# EAGLE design data_proV1.3 (EAGLE 7.6.0)
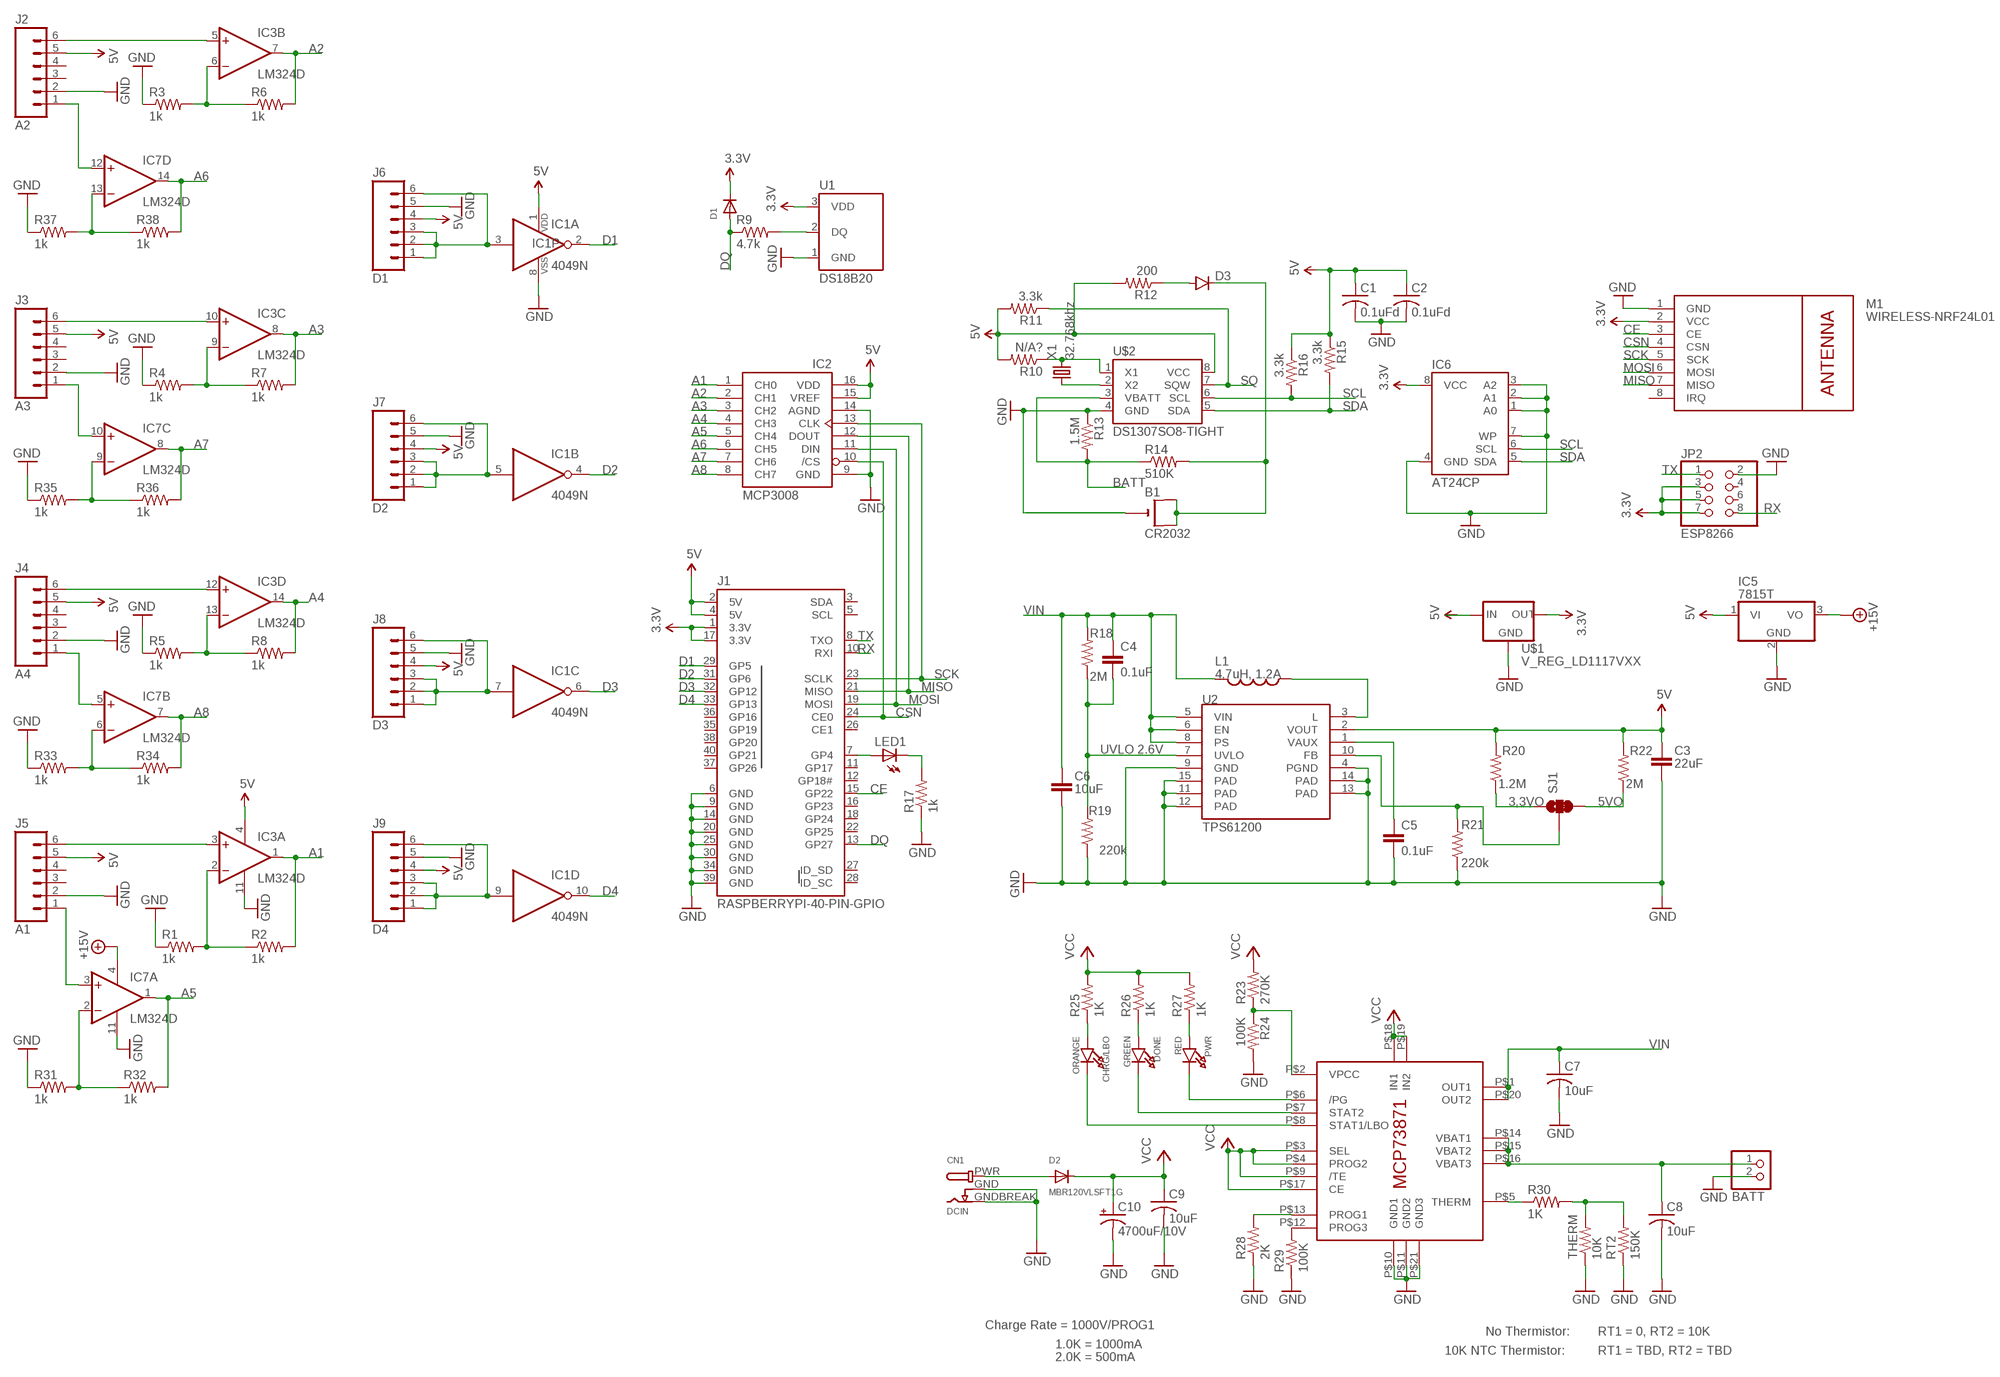
[diagram p0: schematic, sheet 1]

## Parts
B1  CR2032  CR2032SMT  [CR2032-SMD]
BATT  JST_2PIN-SMT-RA  [JST-PH-2-SMT-RA]
C1  0.1uFd  C-USC0805  [C0805]
C2  0.1uFd  C-USC0805  [C0805]
C3  22uF  CAP0805  [0805]
C4  0.1uF  CAP0603-CAP  [0603-CAP]
C5  0.1uF  CAP0603-CAP  [0603-CAP]
C6  10uF  CAP1206  [1206]
C7  10uF  C-USC0805K  [C0805K]
C8  10uF  C-USC0805K  [C0805K]
C9  10uF  C-USC0805K  [C0805K]
C10  4700uF/10V  CPOL-USE5-13  [E5-13]
CHRG/LBO  ORANGE  LED0805_NOOUTLINE  [CHIPLED_0805_NOOUTLINE]
CN1  DCIN  DCBARRELSMT  [DCJACK_2MM_SMT]
D1  DIODESOD-323F  [SOD-323F]
D2  MBR120VLSFT1G  DIODESOD-123  [SOD-123]
D3  DIODESMB  [SMB-DIODE]
DONE  GREEN  LED0805_NOOUTLINE  [CHIPLED_0805_NOOUTLINE]
IC1  4049N  [DIL16]
IC2  MCP3008  [DIL16]
IC3  LM324D  [SO14]
IC4  MCP73871  [QFN20_4MM]
IC5  7815T  [TO220H]
IC6  AT24CP  [DIL08]
IC7  LM324D  [SO14]
J1  RASPBERRYPI-40-PIN-GPIO  [2X20-SHROUDED]
J2  A2  M06VERNIER-ANALOG  [BTA]
J3  A3  M06VERNIER-ANALOG  [BTA]
J4  A4  M06VERNIER-ANALOG  [BTA]
J5  A1  M06VERNIER-ANALOG  [BTA]
J6  D1  M06VERNIER-DIGITAL  [BTD]
J7  D2  M06VERNIER-DIGITAL  [BTD]
J8  D3  M06VERNIER-DIGITAL  [BTD]
J9  D4  M06VERNIER-DIGITAL  [BTD]
JP2  ESP8266  PINHD-2X4  [2X04]
L1  4.7uH, 1.2A  INDUCTOR.  [CDRH2D09]
LED1  LEDCHIP-LED0805  [CHIP-LED0805]
M1  WIRELESS-NRF24L01  [WIRELESS-NRF24L01]
PWR  RED  LED0805_NOOUTLINE  [CHIPLED_0805_NOOUTLINE]
R1  1k  R-US_R0805  [R0805]
R2  1k  R-US_R0805  [R0805]
R3  1k  R-US_R0805  [R0805]
R4  1k  R-US_R0805  [R0805]
R5  1k  R-US_R0805  [R0805]
R6  1k  R-US_R0805  [R0805]
R7  1k  R-US_R0805  [R0805]
R8  1k  R-US_R0805  [R0805]
R9  4.7k  R-US_R0805  [R0805]
R10  N/A?  R-US_R0805  [R0805]
R11  3.3k  R-US_R0805  [R0805]
R12  200  R-US_R0805  [R0805]
R13  1.5M  R-US_R0805  [R0805]
R14  510K  R-US_R0805  [R0805]
R15  3.3k  R-US_R0805  [R0805]
R16  3.3k  R-US_R0805  [R0805]
R17  1k  R-US_R0805  [R0805]
R18  2M  RESISTOR0603-RES  [0603-RES]
R19  220k  RESISTOR0603-RES  [0603-RES]
R20  1.2M  RESISTOR0603-RES  [0603-RES]
R21  220k  RESISTOR0603-RES  [0603-RES]
R22  2M  RESISTOR0603-RES  [0603-RES]
R23  270K  R-US_R0805  [R0805]
R24  100K  R-US_R0805  [R0805]
R25  1K  R-US_R0805  [R0805]
R26  1K  R-US_R0805  [R0805]
R27  1K  R-US_R0805  [R0805]
R28  2K  R-US_FLIPFLOP  [0805-THM]
R29  100K  R-US_R0805  [R0805]
R30  1K  R-US_M0805  [M0805]
R31  1k  R-US_R0805  [R0805]
R32  1k  R-US_R0805  [R0805]
R33  1k  R-US_R0805  [R0805]
R34  1k  R-US_R0805  [R0805]
R35  1k  R-US_R0805  [R0805]
R36  1k  R-US_R0805  [R0805]
R37  1k  R-US_R0805  [R0805]
R38  1k  R-US_R0805  [R0805]
RT2  150K  R-US_M0805  [M0805]
SJ1  SOLDERJUMPER_2WAYPASTE2&3  [SJ_3_PASTE2&3]
THERM  10K  R-US_FLIPFLOP  [0805-THM]
U1  DS18B20  [TO-92-AMMO]
U2  TPS61200  [QFN-10_PAD]
U$1  V_REG_LD1117VXX  [78XXL]
U$2  DS1307SO8-TIGHT  [SO08-TIGHT]
X1  32.768khz  CRYSTALTC38H  [TC38H]

## Nets
3.3V: D1.C IC6.8(VCC) J1.1(3.3V) J1.17(3.3V) JP2.3 JP2.5 JP2.7 M1.2(VCC) U1.3(VDD) U$1.GND(OUT)
3.3VO: R20.1 SJ1.1
5V: C1.1 C2.1 C3.1 IC1.1(P:VDD) IC2.15(VREF) IC2.16(VDD) IC3.4(P:V+) IC5.1(VI) J1.2(5V) J1.4(5V) J2.5 J3.5 J4.5 J5.5 J6.4 J7.4 J8.4 J9.4 R10.2 R11.2 R12.2 R15.1 R16.1 R20.2 R22.2 U2.2(VOUT) U$1.OUT(IN) U$2.8(VCC)
5VO: R22.1 SJ1.3
+15V: IC5.3(VO) IC7.4(P:V+)
A1: IC2.1(CH0) IC3.1(A:OUT) R2.2
A2: IC2.2(CH1) IC3.7(B:OUT) R6.2
A3: IC2.3(CH2) IC3.8(C:OUT) R7.2
A4: IC2.4(CH3) IC3.14(D:OUT) R8.2
A5: IC2.5(CH4) IC7.1(A:OUT) R32.2
A6: IC2.6(CH5) IC7.14(D:OUT) R38.2
A7: IC2.7(CH6) IC7.8(C:OUT) R36.2
A8: IC2.8(CH7) IC7.7(B:OUT) R34.2
BATT: R13.2 R14.1 U$2.3(VBATT)
BATT1: BATT.1 C8.1 IC4.P$14(VBAT1) IC4.P$15(VBAT2) IC4.P$16(VBAT3)
CE: J1.15(GP22) M1.3(CE)
CSN: IC2.10(/CS) J1.24(CE0) M1.4(CSN)
D1: IC1.2(A:O) J1.29(GP5)
D2: IC1.4(B:O) J1.31(GP6)
D3: IC1.6(C:O) J1.32(GP12)
D4: IC1.10(D:O) J1.33(GP13)
DQ: D1.A J1.13(GP27) R9.1
FB: R21.2 SJ1.2 U2.10(FB)
GND: B1.- BATT.2 C1.2 C2.2 C3.2 C5.2 C6.2 C7.2 C8.2 C9.2 C10.- CN1.GND(GNDBREAK) CN1.GNDBREAK(GND) IC1.8(P:VSS) IC2.9(GND) IC2.14(AGND) IC3.11(P:V-) IC4.P$10(GND1) IC4.P$11(GND2) IC4.P$21(GND3) IC5.2(GND) IC6.1(A0) IC6.2(A1) IC6.3(A2) IC6.4(GND) IC6.7(WP) IC7.11(P:V-) J1.6(GND) J1.9(GND) J1.14(GND) J1.20(GND) J1.25(GND) J1.30(GND) J1.34(GND) J1.39(GND) J2.2 J3.2 J4.2 J5.2 J6.5 J7.5 J8.5 J9.5 JP2.2 M1.1(GND) R1.1 R3.1 R4.1 R5.1 R13.1 R17.1 R19.1 R21.1 R24.2 R28.1 R29.1 R31.1 R33.1 R35.1 R37.1 RT2.1 THERM.1 U1.1(GND) U2.4(PGND) U2.9(GND) U2.11(PAD) U2.12(PAD) U2.13(PAD) U2.14(PAD) U2.15(PAD) U$1.IN(GND) U$2.4(GND)
MISO: IC2.12(DOUT) J1.21(MISO) M1.7(MISO)
MOSI: IC2.11(DIN) J1.19(MOSI) M1.6(MOSI)
N$1: U$2.2(X2) X1.1
N$2: R10.1 U$2.1(X1) X1.2
N$3: B1.+$1(+) B1.+$2(+1) D3.C R14.2
N$4: J1.7(GP4) LED1.A
N$5: IC3.2(A:-IN) R1.2 R2.1
N$6: R9.2 U1.2(DQ)
N$7: IC3.13(D:-IN) R5.2 R8.1
N$8: IC3.6(B:-IN) R3.2 R6.1
N$9: L1.P$1 U2.3(L)
N$10: D3.A R12.1
N$11: IC1.3(A:I) J6.1 J6.2 J6.3 J6.6
N$12: IC1.5(B:I) J7.1 J7.2 J7.3 J7.6
N$13: C5.1 U2.1(VAUX)
N$14: IC1.7(C:I) J8.1 J8.2 J8.3 J8.6
N$15: IC1.9(D:I) J9.1 J9.2 J9.3 J9.6
N$16: IC3.9(C:-IN) R4.2 R7.1
N$17: LED1.C R17.2
N$18: IC4.P$2(VPCC) R23.1 R24.1
N$19: IC4.P$6(/PG) PWR.C
N$20: DONE.C IC4.P$7(STAT2)
N$21: CHRG/LBO.C IC4.P$8(STAT1/LBO)
N$22: CHRG/LBO.A R25.1
N$23: DONE.A R26.1
N$24: PWR.A R27.1
N$25: IC4.P$12(PROG3) R29.2
N$26: IC4.P$13(PROG1) R28.2
N$27: IC4.P$5(THERM) R30.1
N$28: R30.2 RT2.2 THERM.2
N$29: CN1.PWR D2.A
N$30: IC3.3(A:+IN) J5.6
N$31: IC7.2(A:-IN) R31.2 R32.1
N$32: IC7.3(A:+IN) J5.1
N$33: IC7.6(B:-IN) R33.2 R34.1
N$34: IC7.9(C:-IN) R35.2 R36.1
N$35: IC7.13(D:-IN) R37.2 R38.1
N$36: IC7.12(D:+IN) J2.1
RX: J1.10(RXI) JP2.8
S1-5V1: IC3.5(B:+IN) J2.6
S1-5V2: IC3.10(C:+IN) J3.6
S1-5V3: IC7.5(B:+IN) J4.1
S1-5V4: IC3.12(D:+IN) J4.6
S1-5V5: IC7.10(C:+IN) J3.1
SCK: IC2.13(CLK) J1.23(SCLK) M1.5(SCK)
SCL: IC6.6(SCL) R16.2 U$2.6(SCL)
SDA: IC6.5(SDA) R15.2 U$2.5(SDA)
SQ: R11.1 U$2.7(SQW)
TX: J1.8(TXO) JP2.1
UVLO: C4.2 R18.1 R19.2 U2.7(UVLO)
VCC: C9.1 C10.+ D2.C IC4.P$3(SEL) IC4.P$4(PROG2) IC4.P$9(/TE) IC4.P$17(CE) IC4.P$18(IN1) IC4.P$19(IN2) R23.2 R25.2 R26.2 R27.2
VIN: C4.1 C6.1 C7.1 IC4.P$1(OUT1) IC4.P$20(OUT2) L1.P$2 R18.2 U2.5(VIN) U2.6(EN) U2.8(PS)
Unconnected: IC1.11(E:I) IC1.12(E:O) IC1.14(F:I) IC1.15(F:O) J1.3(SDA) J1.5(SCL) J1.11(GP17) J1.12(GP18#) J1.16(GP23) J1.18(GP24) J1.22(GP25) J1.26(CE1) J1.27(ID_SD) J1.28(ID_SC) J1.35(GP19) J1.36(GP16) J1.37(GP26) J1.38(GP20) J1.40(GP21) J2.3 J2.4 J3.3 J3.4 J4.3 J4.4 J5.3 J5.4 JP2.4 JP2.6 M1.8(IRQ)

## Notes on the sheet
- UVLO 2.6V
- Charge Rate = 1000V/PROG1
- No Thermistor: | RT1 = 0, RT2 = 10K
- 1.0K = 1000mA
- 10K NTC Thermistor: | RT1 = TBD, RT2 = TBD
- 2.0K = 500mA

## Library data of the parts
B1 = adafruit:CR2032
BATT = adafruit:JST_2PIN: JST 2-Pin Connectors of various flavors SMT-RA (S2B-PH-SM4) 4UConnector #17311 SMT (B2B-PH-SM4) THM-RA (S2B-PH) THM (B2B-PH)
C1 C2 = resistor:C-US: CAPACITOR, American symbol
C3 C6 = CH_passive:CAP: Capacitor Standard 0603 ceramic capacitor, and 0.1" leaded capacitor.
C4 C5 = SparkFun:CAP: Capacitor Standard 0603 ceramic capacitor, and 0.1" leaded capacitor.
C7-C9 = adafruit:C-US: CAPACITOR, American symbol
C10 = adafruit:CPOL-US: POLARIZED CAPACITOR, American symbol
CHRG/LBO DONE PWR = microbuilder:LED: LED
CN1 = microbuilder:DCBARREL: DC Barrel Jack DCJACK_1.3MM_PTH - Through Hole 1.3mm Jack (4UConnector: 05536) DCJACK_2MM_PTH - Through Hole 2.0/2.1 Jack (4UConnector: 05537) DCJACK_2MM_SMT - SMT 2.0/2.1mm Jack(4UConnector: 03267)
D1 = adafruit:DIODE: Diode
D2 = microbuilder:DIODE: Diode
D3 = SparkFun-DiscreteSemi:DIODE: Diode; PROD_ID: DIO-09646
IC1 = 40xx:4049: Hex inverting BUFFER
IC2 = adafruit:MCP3008
IC3 IC7 = linear:LM324: OP AMP
IC4 = adafruit:MCP73871
IC5 = linear:78*: Positive VOLTAGE REGULATOR Source: http://cache.national.com/ds/LM/LM78L05.pdf http://www.fairchildsemi.com/ds/LM/LM7805.pdf
IC6 = atmel:AT24C*: 2-wire serial EEPROM; MPN: AT24C1024BW-SH-B; OC_FARNELL: 1362646; OC_NEWARK: 03P2044
J1 = SparkFun-Boards:RASPBERRYPI-40-PIN-GPIO: Second Generation Raspberry Pi GPIO Header 2x20 pin connector, as found on B, B+, A+ models.
J2-J9 = SparkFun-Connectors:M06: Header 6 Standard 6-pin 0.1" header. Use with straight break away headers (SKU : PRT-00116), right angle break away headers (PRT-00553), swiss pins (PRT-00743), machine pins (PRT-00117), and female headers (PRT-00115). Molex polarized connector foot print use with SKU : PRT-08094 with associated crimp pins and housings. NOTES ON THE VARIANTS LOCK and LOCK_LONGPADS... This footprint was designed to help hold the alignment of a through-hole component (i.e. 6-pin header) while soldering it into place. You may notice that each hole has been shifted either up or down by 0.005 of an inch from it's more standard position (which is a perfectly straight line). This slight alteration caused the pins (the squares in the middle) to touch the edges of the holes. Because they are alternating, it causes a "brace" to hold the component in place. 0.005 has proven to be the perfect amount of "off-center" position when using our standard breakaway headers. Although looks a little odd when you look at the bare footprint, once you have a header in there, the alteration is very hard to notice. Also,if you push a header all the way into place, it is covered up entirely on the bottom side. This idea of altering the position of holes to aid alignment will be further integrated into the Sparkfun Library for other footprints. It can help hold any component with 3 or more connection pins.
JP2 = adafruit:PINHD-2X4: PIN HEADER
L1 = SparkFun:INDUCTOR: Inductors Basic Inductor/Choke - 0603 and 1206. Footprints are not proven and vary greatly between part numbers.
LED1 = led:LED: LED
M1 = diy-modules:WIRELESS-NRF24L01: 2.4 GHz Wireless Module based on NRF24L01 chip More details available here: http://www.electrodragon.com/w/NRF24L01 Click here to find device on ebay.com <http://www.ebay.com/sch/nrf24l01+arduino>
R1-R9 R31-R38 = resistor:R-US_: RESISTOR, American symbol
R10-R17 R23-R30 RT2 THERM = adafruit:R-US_: RESISTOR, American symbol
R18-R22 = SparkFun:RESISTOR: Resistor Basic schematic elements and footprints for 0603, 1206, and PTH resistors.
SJ1 = SparkFun:SOLDERJUMPER_2WAY: Solder Jumper 2 way solder jumper
U1 = SparkFun-Sensors:DS18B20: Dallas/Maxim DS18B20 1-wire temperature sensor Datasheet: http://datasheets.maximintegrated.com/en/ds/DS18B20.pdf temp thermometer 1-wire one-wire one wire; STORE_ID: SEN-00245
U2 = SparkFun:TPS61200: DC to DC Booster
U$1 = SparkFun-PowerIC:V_REG_LD1117VXX: LD1117VXX voltage regulator. We carry the 3.3V version (COM-00526) in TO-220 package.
U$2 = SparkFun-FreqCtrl:DS1307: I2C real-time clock with battery backup.; PROD_ID: IC-08138
X1 = crystal:CRYSTAL: CRYSTAL; OC_FARNELL: unknown; OC_NEWARK: unknown

## Board
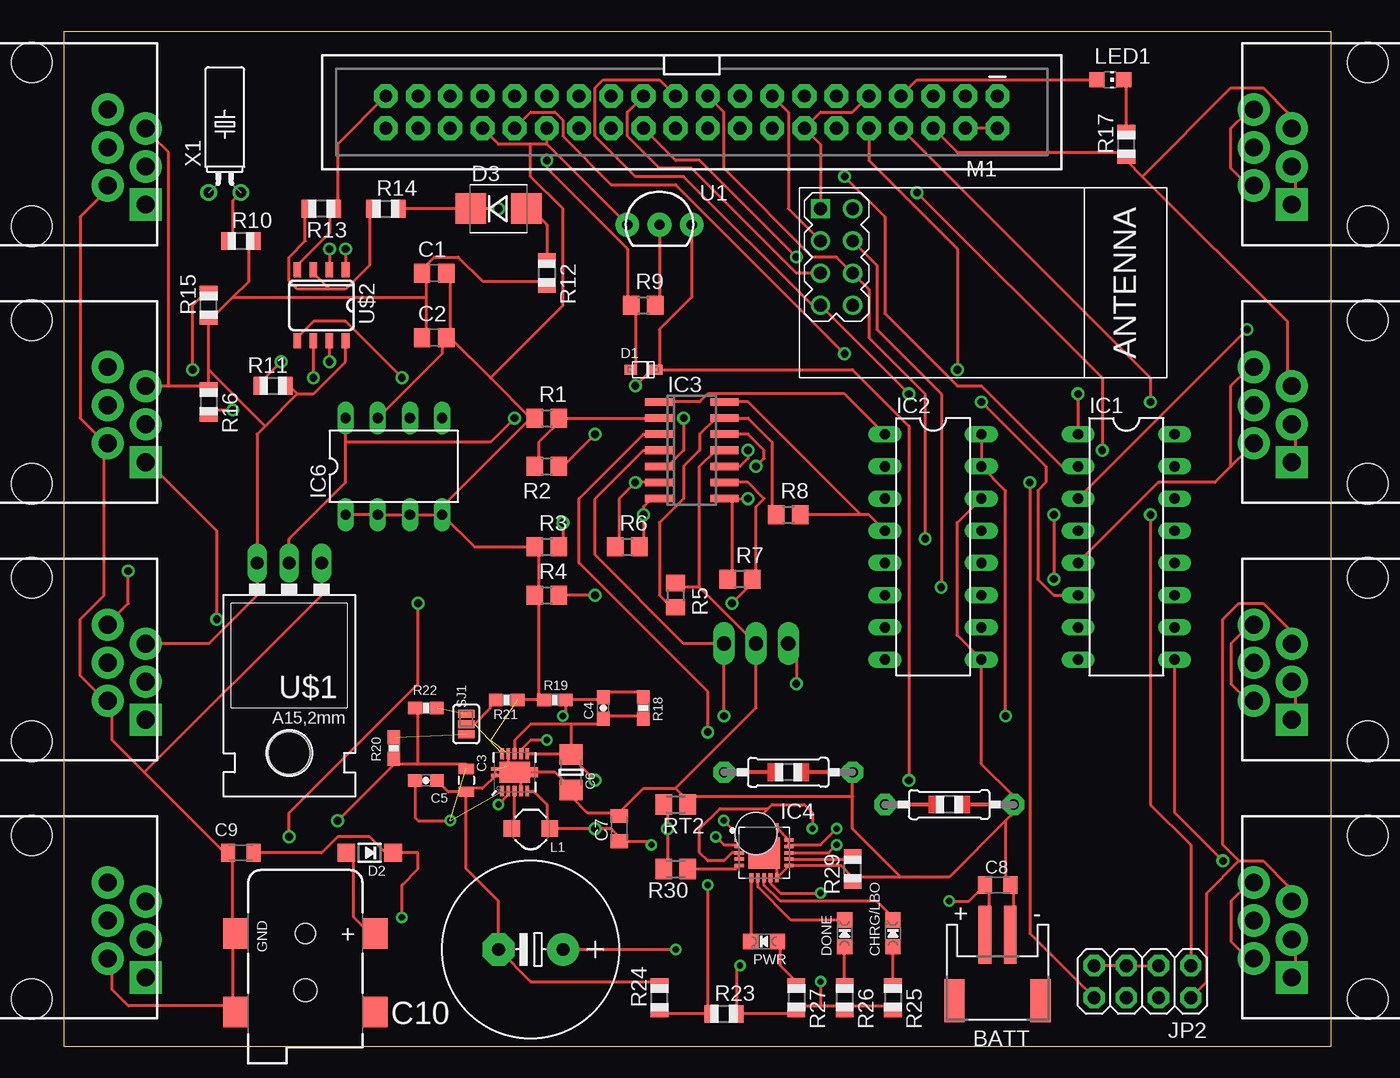
[diagram p1: board, top side]
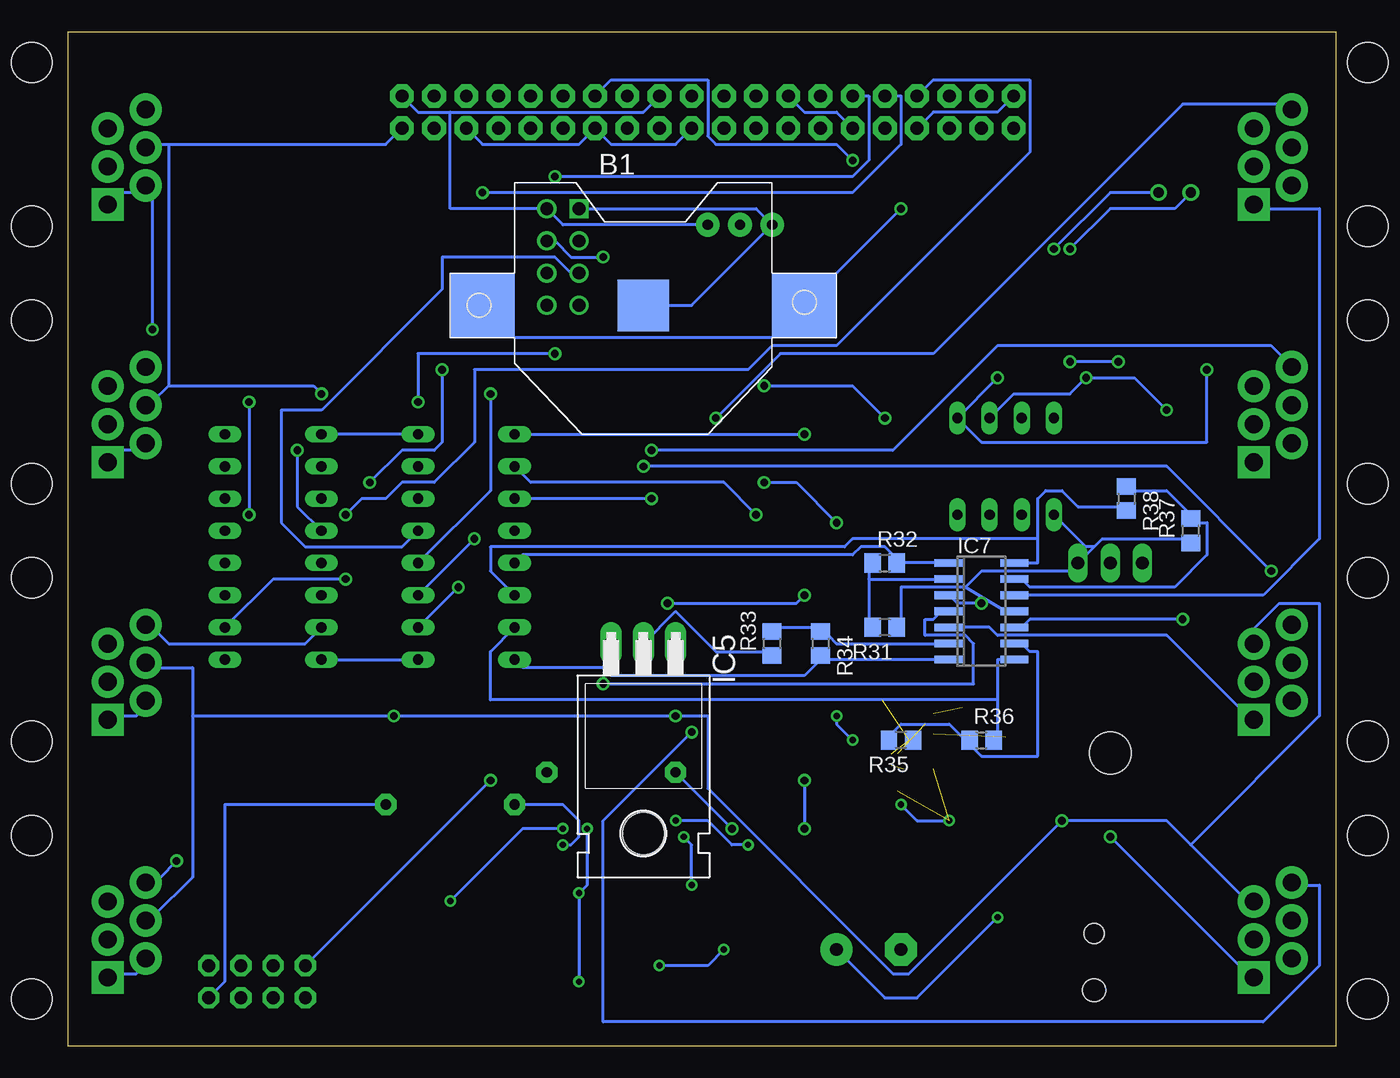
[diagram p2: board, bottom side, seen from below]

Size 100 x 80 mm. Coordinates in mm from the lower left corner, seen from the top.
Outline: 0,0 100,0 100,80 0,80 0,0
Copper layers (1*16): Top 0.035mm / dielectric 1.5mm / Bottom 0.035mm
Design rules "default": minimum track width 10mil, minimum drill 24mil, track to track 8mil, track to pad 8mil, pad to pad 8mil, via to via 8mil, smd to smd 8mil, copper to edge 40mil, drill to drill 8mil, minimum pad ring 10mil, minimum via ring 8mil, stop-mask expansion 4mil, vias tented up to drill 0mil, thermal gap 10mil

### Footprints (pad centres in the part's own frame; a part is rotated, then mirrored left to right if it is on the bottom)
CR2032-SMD = smd 5.08 x 5.08: +$1 -12.7,0; +$2 12.7,0 | smd 4.064 x 4.064: - 0,0
JST-PH-2-SMT-RA = smd 1 x 4.6: 1 1,-3.7; 2 -1,-3.7 | smd 1.6 x 3.4: NC1 -3.4,1.5; NC2 3.4,1.5
C0805 = smd 1.3 x 1.5: 1 -0.95,0; 2 0.95,0
0805 = smd 0.8 x 1.2: 1 -0.9,0; 2 0.9,0
0603-CAP = smd 1.1 x 1: 1 -0.85,0; 2 0.85,0
1206 = smd 1.6 x 1.8: 1 -1.4,0; 2 1.4,0
C0805K = smd 1.1 x 1.4: 1 -1,0; 2 1,0
E5-13 = drill 1.016 pad 2.54: + -2.54,0 | drill 1.016 pad 2.54 octagon: - 2.54,0
CHIPLED_0805_NOOUTLINE = smd 1.2 x 1.2: A 0,-1.05; C 0,1.05
DCJACK_2MM_SMT = smd 2.4 x 2: GND 0,-5.5; GNDBREAK 6.2,-5.5; PWR 0,5.5; PWR2 6.2,5.5 | hole 1.6: 0,0 | hole 1.8: 4.5,0
SOD-323F = smd 1 x 0.8: A -1,0; C 1,0
SOD-123 = smd 1.4 x 1.4: A 1.85,0; C -1.85,0
SMB-DIODE = smd 2.4 x 2.4: A 2.2,0; C -2.2,0
DIL16 = drill 0.813 long: 1 -8.89,-3.81; 2 -6.35,-3.81; 3 -3.81,-3.81; 4 -1.27,-3.81; 5 1.27,-3.81; 6 3.81,-3.81; 7 6.35,-3.81; 8 8.89,-3.81; 9 8.89,3.81; 10 6.35,3.81; 11 3.81,3.81; 12 1.27,3.81; 13 -1.27,3.81; 14 -3.81,3.81; 15 -6.35,3.81; 16 -8.89,3.81
SO14 = smd 0.6 x 2.2: 1 -3.81,-2.6; 2 -2.54,-2.6; 3 -1.27,-2.6; 4 0,-2.6; 5 1.27,-2.6; 6 2.54,-2.6; 7 3.81,-2.6; 8 3.81,2.6; 9 2.54,2.6; 10 1.27,2.6; 11 0,2.6; 12 -1.27,2.6; 13 -2.54,2.6; 14 -3.81,2.6
QFN20_4MM = smd 0.73 x 0.28: P$1 -1.965,1; P$2 -1.965,0.5; P$3 -1.965,0; P$4 -1.965,-0.5; P$5 -1.965,-1; P$11 1.965,-1; P$12 1.965,-0.5; P$13 1.965,0; P$14 1.965,0.5; P$15 1.965,1 | smd 0.28 x 0.73: P$6 -1,-1.965; P$7 -0.5,-1.965; P$8 0,-1.965; P$9 0.5,-1.965; P$10 1,-1.965; P$16 1,1.965; P$17 0.5,1.965; P$18 0,1.965; P$19 -0.5,1.965; P$20 -1,1.965 | smd 2.5 x 2.5: P$21 0,0
TO220H = drill 1.118 long: 1 -2.54,-10.16; 2 0,-10.16; 3 2.54,-10.16 | hole 3.302: 0,4.826
DIL08 = drill 0.813 long: 1 -3.81,-3.81; 2 -1.27,-3.81; 3 1.27,-3.81; 4 3.81,-3.81; 5 3.81,3.81; 6 1.27,3.81; 7 -1.27,3.81; 8 -3.81,3.81
2X20-SHROUDED = drill 1.016 pad 1.88 octagon: 1 -1.27,24.13; 2 1.27,24.13; 3 -1.27,21.59; 4 1.27,21.59; 5 -1.27,19.05; 6 1.27,19.05; 7 -1.27,16.51; 8 1.27,16.51; 9 -1.27,13.97; 10 1.27,13.97; 11 -1.27,11.43; 12 1.27,11.43; 13 -1.27,8.89; 14 1.27,8.89; 15 -1.27,6.35; 16 1.27,6.35; 17 -1.27,3.81; 18 1.27,3.81; 19 -1.27,1.27; 20 1.27,1.27; 21 -1.27,-1.27; 22 1.27,-1.27; 23 -1.27,-3.81; 24 1.27,-3.81; 25 -1.27,-6.35; 26 1.27,-6.35; 27 -1.27,-8.89; 28 1.27,-8.89; 29 -1.27,-11.43; 30 1.27,-11.43; 31 -1.27,-13.97; 32 1.27,-13.97; 33 -1.27,-16.51; 34 1.27,-16.51; 35 -1.27,-19.05; 36 1.27,-19.05; 37 -1.27,-21.59; 38 1.27,-21.59; 39 -1.27,-24.13; 40 1.27,-24.13
BTA = drill 1.4 pad 2.54 square: 1 4.75,9 | drill 1.4 pad 2.54: 2 3.25,6; 3 1.75,9; 4 0.25,6; 5 -1.25,9; 6 -2.75,6 | hole 3.2: 6.45,0; -6.45,0
BTD = drill 1.4 pad 2.54 square: 1 -4.75,6 | drill 1.4 pad 2.54: 2 -3.25,9; 3 -1.75,6; 4 -0.25,9; 5 1.25,6; 6 2.75,9 | hole 3.2: 6.45,0; -6.45,0
2X04 = drill 1.016 pad 1.676 octagon: 1 -3.81,-1.27; 2 -3.81,1.27; 3 -1.27,-1.27; 4 -1.27,1.27; 5 1.27,-1.27; 6 1.27,1.27; 7 3.81,-1.27; 8 3.81,1.27
CDRH2D09 = smd 1.3 x 1.3: P$1 -1.5,0; P$2 1.5,0
CHIP-LED0805 = smd 1.2 x 1.2: A 0,-1.05; C 0,1.05
WIRELESS-NRF24L01 = drill 1 square: 1 -12.7,6.35 | drill 1: 2 -10.16,6.35; 3 -12.7,3.81; 4 -10.16,3.81; 5 -12.7,1.27; 6 -10.16,1.27; 7 -12.7,-1.27; 8 -10.16,-1.27
R0805 = smd 1.3 x 1.5: 1 -0.95,0; 2 0.95,0
R0805' = smd 1.1 x 1.4: 1 -1,0; 2 1,0
0603-RES = smd 1.1 x 1: 1 -0.85,0; 2 0.85,0
0805-THM = drill 0.813 pad 1.676 octagon: 1 -5.08,0; 2 5.08,0
M0805 = smd 1.3 x 1.6: 1 -0.95,0; 2 0.95,0
SJ_3_PASTE2&3 = smd 0.635 x 1.27: 1 -0.813,0; 2 0,0; 3 0.813,0
TO-92-AMMO = drill 0.813 pad 1.88: 1 -2.54,0; 2 0,0; 3 2.54,0
QFN-10_PAD = smd 0.297 x 0.85: 1 -1,-1.475; 2 -0.5,-1.475; 3 0,-1.475; 4 0.5,-1.475; 5 1,-1.475; 6 1,1.475; 7 0.5,1.475; 8 0,1.475; 9 -0.5,1.475; 10 -1,1.475 | smd 0.7 x 0.28: 11 -1.5,0.25; 12 -1.5,-0.25; 13 1.5,0.25; 14 1.5,-0.25 | smd 2.4 x 1.65: 15 0,0
78XXL = drill 1.016 long: GND 0,-3.81; IN -2.54,-3.81; OUT 2.54,-3.81 | hole 3.302: 0,11.176
SO08-TIGHT = smd 0.6 x 1.2: 1 -1.905,-2.8; 2 -0.635,-2.8; 3 0.635,-2.8; 4 1.905,-2.8; 5 1.905,2.8; 6 0.635,2.8; 7 -0.635,2.8; 8 -1.905,2.8
TC38H = drill 0.813: 1 -1.27,0; 2 1.27,0

### Placement (x,y rotation side)
B1  54.61,58.42 0 bottom
BATT  73.66,5.08 180 top
C1  29.21,60.96 0 top
C2  29.21,55.88 0 top
C3  31.75,20.95 270 top
C4  42.55,26.67 90 top
C5  28.57,20.95 0 top
C6  40.01,21.59 270 top
C7  43.81,17.14 90 top
C8  73.66,12.7 0 top
C9  13.97,15.24 180 top
C10  36.83,7.62 180 top
CHRG/LBO  65.41,8.89 0 top
CN1  19.05,8.89 270 top
D1  45.72,53.34 0 top
D2  24.13,15.24 180 top
D3  34.29,66.04 0 top
DONE  61.59,8.89 0 top
IC1  83.82,39.37 270 top
IC2  68.58,39.37 270 top
IC3  49.53,46.99 270 top
IC4  55.24,15.24 0 top
IC5  54.61,21.59 180 bottom
IC6  26.04,45.72 0 top
IC7  27.94,34.29 270 bottom
J1  49.53,73.66 270 top
J2  -2.54,71.12 270 top
J3  -2.54,50.8 270 top
J4  -2.54,30.48 270 top
J5  -2.54,10.16 270 top
J6  102.87,71.12 90 top
J7  102.87,50.8 90 top
J8  102.87,30.48 90 top
J9  102.87,10.16 90 top
JP2  85.09,5.08 180 top
L1  36.83,17.14 0 top
LED1  82.55,76.2 270 top
M1  72.39,59.69 0 top
PWR  55.24,8.26 90 top
R1  38.1,49.53 0 top
R2  38.1,45.72 0 top
R3  38.1,39.37 0 top
R4  38.1,35.56 0 top
R5  48.26,35.56 270 top
R6  44.45,39.37 0 top
R7  53.34,36.83 180 top
R8  57.15,41.91 0 top
R9  45.72,58.42 0 top
R10  N/A?  [R0805']  13.97,63.5 0 top
R11  3.3k  [R0805']  16.51,52.07 0 top
R12  200  [R0805']  38.1,60.96 270 top
R13  1.5M  [R0805']  20.32,66.04 180 top
R14  510K  [R0805']  25.4,66.04 0 top
R15  3.3k  [R0805']  11.43,58.42 90 top
R16  3.3k  [R0805']  11.43,50.8 270 top
R17  1k  [R0805']  83.82,71.12 90 top
R18  45.72,26.67 270 top
R19  38.73,27.3 0 top
R20  26.04,23.5 270 top
R21  34.92,27.3 180 top
R22  28.57,26.67 180 top
R23  270K  [R0805']  52.07,2.54 0 top
R24  100K  [R0805']  46.99,3.81 90 top
R25  1K  [R0805']  65.41,3.81 270 top
R26  1K  [R0805']  61.59,3.81 270 top
R27  1K  [R0805']  57.78,3.81 270 top
R28  69.85,19.05 180 top
R29  100K  [R0805']  62.23,13.97 90 top
R30  48.26,13.97 180 top
R31  35.56,33.02 180 bottom
R32  35.56,38.1 0 bottom
R33  44.45,31.75 90 bottom
R34  40.64,31.75 270 bottom
R35  34.29,24.13 180 bottom
R36  27.94,24.13 0 bottom
R37  11.43,40.64 90 bottom
R38  16.51,43.18 270 bottom
RT2  48.26,19.05 180 top
SJ1  31.75,25.4 90 top
THERM  57.15,21.59 180 top
U1  46.99,64.77 0 top
U2  35.56,21.59 0 top
U$1  17.78,34.29 180 top
U$2  20.32,58.42 180 top
X1  12.7,67.31 0 top

### Tracks (layer width: path | path; a pad name or v marks a point on that pad's centre or on a via)
3.3V  (via drill 0.61)
  Top 0.254: 22.23,47.62 22.23,44.45 17.78,40.01 U$1.GND | 22.23,47.62 IC6.8 | JP2.7 JP2.5 JP2.3 | 46.99,53.34 46.99,56.52 49.53,59.05 U1.3 | v66.67,20.95 66.67,48.9 62.23,53.34 46.99,53.34 | 46.99,53.34 D1.C 46.35,53.34 v45.09,52.07 | 22.23,47.62 33.66,47.62 v35.56,49.53
  Bottom 0.254: J1.17 54.61,73.66 69.85,73.66 | 69.85,73.66 72.39,73.66 J1.1 | U1.3 60.96,64.77 M1.2 69.85,66.04 69.85,73.66 | v66.67,20.95 JP2.7 | v35.56,49.53 38.1,52.07 v45.09,52.07
3.3VO  (1 unrouted)
5V  (via drill 0.5, 0.61)  (1 unrouted)
  Top 0.254: 27.94,22.23 31.75,22.23 C3.1 | 27.94,22.23 26.04,22.23 | 27.94,22.23 27.94,26.67 R22.2 | v21.59,17.78 26.04,22.23 | 26.04,22.23 R20.2 | U$2.8 22.23,53.98 19.68,51.44 18.41,51.44 | 18.41,51.44 17.78,52.07 R11.2 | 18.41,51.44 15.88,48.9 | 15.88,48.9 15.24,48.26 U$1.OUT 15.24,35.56 11.43,31.75 6.99,31.75 J4.5 | R12.2 38.1,60.33 33.02,60.33 31.11,62.23 29.21,62.23 27.94,60.96 C1.1 28.57,60.96 28.57,59.05 | 28.57,59.05 28.57,55.88 C2.1 | 8.26,52.07 6.99,52.07 J3.5 | 8.26,52.07 11.43,52.07 | 11.43,52.07 11.43,53.34 | 11.43,53.34 11.43,57.15 | 11.43,52.07 R16.1 | 11.43,57.15 13.34,59.05 | 13.34,59.05 14.61,60.33 14.61,63.5 R10.2 | 11.43,57.15 R15.1 | 8.26,52.07 8.26,70.48 6.99,71.75 J2.5 | 13.34,59.05 28.57,59.05 | 11.43,53.34 15.88,48.9 | IC2.16 IC2.15 74.3,43.81 v74.3,26.04 | J1.2 J1.4 | v80.01,51.44 IC1.1 | IC3.4 45.72,46.99 41.91,43.18 41.91,38.73 48.9,31.75 IC5.1 v52.07,26.04 | U2.2 35.06,19.82 v34.29,19.05
  Bottom 0.254: 11.43,15.88 6.99,11.43 J5.5 | 11.43,15.88 13.34,17.78 v21.59,17.78 33.66,5.71 34.92,5.71 49.53,20.32 49.53,26.04 v52.07,26.04 v74.3,26.04 90.17,26.04 | 11.43,15.88 1.27,26.04 1.27,34.92 4.45,34.92 6.35,33.02 6.35,31.75 J4.5 | IC2.16 IC1.1 | J1.2 74.93,71.12 92.08,71.12 | 92.08,71.12 93.34,71.12 J6.4 | 92.08,52.07 93.34,50.8 J7.4 | 92.08,71.12 92.08,52.07 | v80.01,51.44 80.64,52.07 92.08,52.07 | 90.17,26.04 90.17,29.84 93.34,29.84 J8.4 | 90.17,26.04 90.17,13.34 93.34,10.16 J9.4 | v34.29,19.05 33.02,17.78 30.48,17.78
5VO  (1 unrouted)
+15V  (via drill 0.61)
  Top 0.254: v57.78,28.57 57.78,31.11 IC5.3
  Bottom 0.254: v57.78,28.57 28.57,28.57 28.57,31.75 29.21,32.38 32.38,32.38 32.38,33.66 31.75,33.66 31.11,34.29 IC7.4
A1  (via drill 0.61)
  Top 0.254: v41.91,48.26 39.37,45.72 R2.2 | IC3.1 50.16,50.8 50.8,51.44 61.59,51.44 IC2.1
  Bottom 0.254: IC2.1 v41.91,48.26
A2  (via drill 0.61)
  Top 0.254: R6.2 45.72,39.37 v45.72,41.91 45.72,42.55 46.35,43.18 IC3.7
  Bottom 0.254: IC2.2 63.5,44.45 48.26,44.45 v45.72,41.91
A3  (via drill 0.61)
  Top 0.254: 52.7,43.18 52.7,36.83 R7.2 | 52.7,43.18 v53.98,43.18 | 52.7,43.18 IC3.8
  Bottom 0.254: v53.98,43.18 IC2.3
A4
  Top 0.254: 62.87,41.91 63.5,41.91 IC2.4 | 62.87,41.91 R8.2 | IC3.14 53.98,50.8 62.87,41.91
A5
  Bottom 0.254: IC7.1 34.29,38.1 | IC2.5 64.14,38.73 38.1,38.73 37.47,39.37 35.56,39.37 34.29,38.1 | 34.29,38.1 R32.2
A6
  Bottom 0.254: 23.5,40.01 23.5,38.1 IC7.14 | 23.5,40.01 23.5,43.18 22.86,43.81 21.59,43.81 20.32,42.55 16.51,42.55 R38.2 | IC2.6 66.67,37.47 66.67,39.37 38.73,39.37 38.1,40.01 23.5,40.01
A7
  Bottom 0.254: 26.67,27.3 26.67,30.48 IC7.8 | 26.67,27.3 26.67,24.13 R36.2 | IC2.7 66.67,31.11 66.67,27.3 26.67,27.3
A8
  Bottom 0.254: IC7.7 40.64,30.48 | IC2.8 64.14,29.84 57.78,29.84 57.15,29.21 41.91,29.21 40.64,30.48 | 40.64,30.48 R34.2
BATT
  Top 0.254: 20.95,59.69 19.68,60.96 U$2.3 | 20.95,59.69 22.23,59.69 24.13,61.59 24.13,66.04 R14.1 | 20.95,59.69 18.41,59.69 17.78,60.33 17.78,62.23 19.05,63.5 19.05,66.04 R13.2
BATT1  (via drill 0.5)
  Top 0.254: BATT.1 73.03,8.89 73.03,12.7 C8.1 71.39,11.43 v69.85,11.43 | IC4.P$16 IC4.P$15 IC4.P$14 57.34,15.88 59.69,15.88 v60.96,17.14
  Bottom 0.254: v60.96,17.14 64.14,17.14 v69.85,11.43
CE
  Top 0.254: M1.3 57.15,66.04 57.15,73.66 J1.15
CSN  (via drill 0.61)
  Top 0.254: v69.22,36.2 69.22,51.44 64.14,56.52 64.14,61.59 M1.4 | J1.24 48.26,69.85 50.16,69.85 v57.78,62.23
  Bottom 0.254: v69.22,36.2 IC2.10 | v57.78,62.23 60.33,62.23 61.59,63.5 M1.4
D1  (via drill 0.61)
  Top 0.254: IC1.2 78.74,45.72 72.39,52.07 70.48,52.07 64.77,57.78 64.77,65.41 v61.59,68.58
  Bottom 0.254: v61.59,68.58 38.1,68.58 36.83,69.85 36.83,74.93 J1.29
D2  (via drill 0.61)
  Top 0.254: v81.92,46.99 81.92,52.7 v67.31,67.31
  Bottom 0.254: IC1.4 81.92,42.55 v81.92,46.99 | v67.31,67.31 38.1,67.31 34.29,71.12 34.29,74.93 J1.31
D3  (via drill 0.61)
  Top 0.254: IC1.6 78.11,35.56 76.83,36.83 76.83,43.81 77.47,44.45 77.47,45.72 v72.39,50.8 | v61.59,54.61 48.26,67.94 43.18,67.94 39.37,71.75 39.37,73.03 38.73,73.66 36.83,73.66 J1.32
  Bottom 0.254: v72.39,50.8 72.39,54.61 v61.59,54.61
D4  (via drill 0.61)
  Top 0.254: v78.11,41.91 v78.11,36.83
  Bottom 0.254: IC1.10 83.82,36.83 v78.11,36.83 | v78.11,41.91 76.83,43.18 74.93,43.18 73.66,44.45 71.12,44.45 67.94,47.62 67.94,53.34 46.35,53.34 44.45,55.24 39.37,55.24 24.13,70.48 24.13,76.2 31.75,76.2 J1.33
DQ  (via drill 0.61)
  Top 0.254: D1.A 45.09,53.34 45.09,58.42 R9.1 44.45,58.42 44.45,62.87 38.1,69.22 v38.1,69.85
  Bottom 0.254: v38.1,69.85 39.37,71.12 48.9,71.12 49.53,71.75 49.53,76.2 57.15,76.2 J1.13
FB  (1 unrouted)
  Top 0.254: SJ1.2 32.38,25.4 33.66,26.67 33.66,27.3 R21.2
GND  (3 unrouted)
  Top 0.254: U$2.4 18.41,61.59 20.95,64.14 20.95,66.04 R13.1 21.59,66.04 21.59,71.12 J1.39 | 38.1,71.12 J1.30 | U1.1 38.1,71.12 | J1.34 34.29,71.12 36.83,71.12 | 38.1,71.12 36.83,71.12 | M1.1 59.69,71.12 J1.14 59.69,73.66 62.23,73.66 J1.9 | J1.6 70.48,70.48 83.82,70.48 R17.1 83.82,69.85 85.09,68.58 | 85.09,68.58 96.52,57.15 96.52,52.07 J7.5 | 85.09,68.58 92.08,75.56 94.61,75.56 96.52,73.66 96.52,72.39 J6.5 | J2.2 3.17,67.31 1.27,65.41 1.27,49.53 3.17,47.62 J3.2 3.17,46.99 3.17,35.56 1.27,33.66 1.27,29.21 3.17,27.3 J4.2 3.81,26.67 3.81,24.13 6.35,21.59 | 13.34,8.89 13.34,15.24 C9.2 12.7,15.24 6.35,21.59 | 13.34,8.89 13.34,3.17 | 13.34,8.89 CN1.GND | 13.34,3.17 5.08,3.17 3.81,4.45 3.81,6.35 J5.2 | 13.34,3.17 CN1.GNDBREAK | IC2.14 70.48,41.27 70.48,32.38 IC2.9 72.39,22.23 74.93,19.68 R28.1 74.93,18.41 74.3,17.78 | BATT.2 74.93,8.89 74.93,12.7 C8.2 74.3,12.7 74.3,17.78 | 66.04,13.34 69.85,13.34 74.3,17.78 | 66.04,13.34 62.23,13.34 | 62.23,13.34 R29.1 | 62.23,19.68 62.23,17.14 66.04,13.34 | 62.23,19.68 THERM.1 | 92.71,14.61 94.61,14.61 96.52,12.7 96.52,11.43 J9.5 | 92.71,14.61 90.17,12.06 90.17,5.08 JP2.2 | 92.71,14.61 91.44,15.88 91.44,33.66 92.71,34.92 94.61,34.92 96.52,33.02 96.52,31.75 J8.5 | 30.48,55.88 30.48,60.96 C1.2 | 30.48,55.88 33.66,52.7 | 33.66,52.7 36.83,49.53 | 30.48,55.88 C2.2 29.84,55.88 29.84,54.61 IC6.7 | 37.47,27.3 R21.1 | 37.47,35.56 37.47,39.37 R3.1 32.38,39.37 IC6.4 29.21,41.91 | 37.47,35.56 37.47,27.3 | 37.47,27.3 R19.1 | 37.47,35.56 R4.1 | IC6.1 IC6.2 IC6.3 29.21,41.91 | 29.21,41.91 36.83,49.53 | 36.83,49.53 R1.1 | 50.16,36.2 48.26,36.2 R5.1 | 50.16,36.2 IC5.2 54.61,26.67 48.26,20.32
  Top 0.254: IC3.11 51.44,46.99 50.16,45.72 50.16,36.2 | 43.81,18.41 41.27,18.41 40.01,19.68 C6.2 40.01,20.32 38.73,21.59 U2.15 | 48.9,19.68 48.9,19.05 RT2.1 48.9,19.68 | 48.26,20.32 48.9,19.68 | 48.26,20.32 45.72,20.32 43.81,18.41 | 43.81,18.41 C7.2 | R24.2 46.99,5.08 36.83,5.08 C10.- 34.29,11.43 31.75,13.97 C3.2 | 48.9,19.68 62.23,19.68 | 6.35,21.59 20.32,35.56 U$1.IN | 36.83,71.12 36.83,68.58 39.37,66.04 39.37,58.42 33.66,52.7 | 62.23,13.34 61.33,14.24 IC4.P$11 IC4.P$10 56.24,14.24 IC4.P$21 | U2.11 U2.12 34.04,21.34 33.02,20.32 32.02,20.32 C3.2 | U2.9 35.06,22.09 U2.15 | U2.14 35.81,21.34 U2.15 | U2.15 36.81,21.59 U2.13 | U2.4 36.06,21.09 U2.15 | C3.2 30.32,20.05 C5.2
  Bottom 0.254: J1.34 31.75,73.66 26.67,73.66 J1.39 | J1.30 39.37,73.66 41.91,73.66 J1.25 | B1.- 50.8,58.42 U1.1 45.72,66.04 M1.1 | J1.20 52.07,71.12 57.15,71.12 J1.14 59.69,71.12 67.31,71.12 J1.6 | IC1.8 IC2.9 | JP2.2 87.63,5.08 87.63,19.05 R28.1 | 29.21,36.2 34.29,36.2 34.29,33.02 R31.1 | 29.21,36.2 26.04,34.29 IC7.11 | 19.05,39.37 U$1.IN 20.95,37.47 27.94,37.47 29.21,36.2 | 19.05,39.37 18.41,40.01 11.43,40.01 R37.1 | IC6.1 19.68,39.37 19.05,39.37 | IC5.2 52.07,34.29 48.9,31.11 44.45,31.11 R33.1 | 33.66,24.13 R35.1
MISO  (via drill 0.61)
  Top 0.254: v66.67,51.44 M1.7 59.05,58.42 48.9,68.58 45.09,68.58 41.91,71.75 41.91,75.56 42.55,76.2 46.99,76.2 J1.21
  Bottom 0.254: IC2.12 66.67,43.81 v66.67,51.44
MOSI  (via drill 0.61)
  Top 0.254: v67.94,40.01 67.94,51.44 63.5,55.88 63.5,59.69 M1.6 60.96,62.23 59.05,62.23 52.07,69.22 52.07,73.66 J1.19
  Bottom 0.254: v67.94,40.01 IC2.11
N$1  (via drill 0.61)
  Top 0.254: v20.95,62.87 U$2.2
  Bottom 0.254: v20.95,62.87 17.78,66.04 12.7,66.04 X1.1
N$2  (via drill 0.61)
  Top 0.254: v22.23,62.87 U$2.1 | X1.2 13.34,66.67 13.34,63.5 R10.1
  Bottom 0.254: v22.23,62.87 17.78,67.31 X1.2
N$3  (via drill 0.61)
  Top 0.254: R14.2 D3.C v34.29,66.04
  Bottom 0.254: v34.29,66.04 B1.+$2 44.45,55.88 64.77,55.88 B1.+$1
N$4
  Top 0.254: LED1.A 67.31,76.2 J1.7
N$5
  Top 0.254: 39.37,49.53 37.47,47.62 37.47,45.72 R2.1 | 39.37,49.53 IC3.2 | 39.37,49.53 R1.2
N$6
  Top 0.254: U1.2 46.99,58.42 R9.2
N$7
  Top 0.254: R5.2 48.26,34.92 47.62,34.92 46.99,35.56 46.99,41.27 48.9,43.18 48.9,45.72 50.16,46.99 50.16,48.26 51.44,49.53 IC3.13 53.98,49.53 55.88,47.62 55.88,41.91 R8.1
N$8  (via drill 0.61)
  Top 0.254: v39.37,41.27 39.37,39.37 R3.2 | IC3.6 v45.09,44.45 43.81,43.18 43.81,39.37 R6.1
  Bottom 0.254: v39.37,41.27 42.55,44.45 v45.09,44.45
N$9
  Top 0.254: 35.56,20.32 U2.3 35.56,17.14 L1.P$1
N$10
  Top 0.254: R12.1 38.1,64.77 36.83,66.04 D3.A
N$11  (via drill 0.61)
  Top 0.254: J6.1 97.16,66.67 97.16,69.22 J6.3 | v93.34,56.52 IC1.3 | J6.6 93.34,73.66 92.08,72.39 92.08,69.22 93.34,67.94 J6.2
  Bottom 0.254: v93.34,56.52 93.34,67.31 J6.2 93.98,67.31 95.89,67.31 96.52,66.67 J6.1
N$12
  Top 0.254: J7.1 97.16,46.35 97.16,48.9 J7.3 | IC1.5 86.36,44.45 90.81,44.45 92.08,45.72 | 92.08,45.72 93.34,46.99 J7.2 | 92.08,45.72 92.08,52.07 93.34,53.34 J7.6
  Bottom 0.254: J7.1 96.52,46.35 95.89,46.99 93.98,46.99 J7.2
N$13  (via drill 0.5)  (1 unrouted)
  Top 0.254: C5.1 27.73,18 27.94,17.78 v30.48,17.78
N$14
  Top 0.254: J8.1 97.16,26.04 97.16,28.57 J8.3 | J8.2 93.34,27.3 92.08,28.57 92.08,31.75 93.34,33.02 J8.6
  Bottom 0.254: J8.2 93.98,26.67 94.61,26.04 96.52,26.04 J8.1 | IC1.7 81.28,31.75 92.08,31.75 93.34,33.02 J8.6
N$15  (via drill 0.61)
  Top 0.254: J9.1 97.16,5.71 97.16,8.26 J9.3 | IC1.9 87.63,18.41 v91.44,14.61 | J9.2 93.34,6.99 92.08,8.26 92.08,11.43 93.34,12.7 J9.6
  Bottom 0.254: J9.2 93.98,6.35 94.61,5.71 96.52,5.71 J9.1 | v91.44,14.61 92.71,13.34 93.34,13.34 J9.6
N$16  (via drill 0.61)
  Top 0.254: v41.91,35.56 R4.2 | 54.61,36.83 v52.7,34.92 | IC3.9 53.98,44.45 55.24,43.18 54.61,42.55 54.61,36.83 | 54.61,36.83 R7.1
  Bottom 0.254: v41.91,35.56 42.55,34.92 v52.7,34.92
N$17
  Top 0.254: R17.2 83.82,76.2 LED1.C
N$18  (via drill 0.5)
  Top 0.254: R24.1 46.99,2.54 R23.1 50.8,2.81 v50.8,12.7 | v51.44,16.51 52.07,15.88 53.15,15.88 IC4.P$2
  Bottom 0.254: v50.8,12.7 50.8,15.88 v51.44,16.51
N$19
  Top 0.254: IC4.P$6 54.2,13.22 PWR.C
N$20
  Top 0.254: DONE.C 57.37,9.94 54.74,12.56 IC4.P$7
N$21
  Top 0.254: 55.24,13.34 IC4.P$8 55.24,12.7 56.52,11.43 64.14,11.43 65.41,10.16 CHRG/LBO.C
N$22
  Top 0.254: R25.1 CHRG/LBO.A
N$23
  Top 0.254: R26.1 DONE.A
N$24
  Top 0.254: PWR.A 56.52,8.26 56.52,6.35 57.78,5.08 R27.1
N$25
  Top 0.254: IC4.P$12 62,14.74 R29.2
N$26  (via drill 0.5)
  Top 0.254: 57.15,15.24 IC4.P$13 60.33,15.24 v60.96,15.88
  Bottom 0.254: v60.96,15.88 60.33,15.88 59.69,16.51 59.69,17.78 60.96,19.05 R28.2
N$27
  Top 0.254: R30.1 53.01,13.97 IC4.P$5
N$28  (via drill 0.61)
  Top 0.254: R30.2 47.62,13.97 v47.62,17.14 47.62,19.05 RT2.2
  Bottom 0.254: THERM.2 v47.62,17.14
N$29
  Top 0.254: D2.A 22.86,15.24 22.86,10.16 24.13,8.89 CN1.PWR
N$30  (via drill 0.61)
  Top 0.254: IC3.3 45.72,48.26 40.64,43.18 40.64,38.1 50.8,27.94 v50.8,24.77
  Bottom 0.254: v50.8,24.77 57.78,17.78 57.78,1.91 5.71,1.91 1.27,6.35 1.27,12.7 3.17,12.7 J5.6
N$31
  Bottom 0.254: 36.83,36.83 36.83,38.1 R32.1 | 36.83,36.83 36.83,33.02 R31.2 | 36.83,36.83 IC7.2
N$32  (via drill 0.61)
  Top 0.254: v27.94,34.92 27.94,28.57 17.78,18.41 v17.78,16.51
  Bottom 0.254: v27.94,34.92 29.84,34.92 30.48,35.56 IC7.3 | v17.78,16.51 6.99,5.71 J5.1
N$33
  Bottom 0.254: R33.2 44.45,33.02 40.64,33.02 R34.1 40.64,32.38 40.01,32.38 39.37,31.75 IC7.6
N$34
  Bottom 0.254: 29.21,24.13 30.48,25.4 34.29,25.4 35.56,24.13 R35.2 | 29.21,24.13 27.94,22.86 23.5,22.86 23.5,31.11 24.13,31.11 24.77,31.75 IC7.9 | 29.21,24.13 R36.1
N$35
  Bottom 0.254: R38.1 16.51,43.81 13.34,43.81 11.43,41.91 R37.2 11.43,41.27 10.16,41.27 10.16,38.73 12.7,36.2 24.13,36.2 24.77,36.83 IC7.13
N$36
  Bottom 0.254: IC7.12 5.71,35.56 1.27,40.01 1.27,66.04 6.35,66.04 J2.1
RX  (via drill 0.61)
  Top 0.254: JP2.8 76.2,8.89 v76.2,44.45 | v70.48,53.34 70.48,62.87 63.5,69.85 J1.10
  Bottom 0.254: v76.2,44.45 73.66,46.99 71.12,46.99 70.48,47.62 v70.48,53.34
S1-5V1  (via drill 0.61)
  Top 0.254: IC3.5 47.62,45.72 48.9,46.99 v48.9,49.53
  Bottom 0.254: v48.9,49.53 43.81,54.61 31.75,54.61 12.06,74.3 3.81,74.3 J2.6
S1-5V2  (via drill 0.61)
  Top 0.254: IC3.10 53.34,45.72 53.98,46.35 v53.98,46.99
  Bottom 0.254: v53.98,46.99 34.92,46.99 26.67,55.24 5.08,55.24 3.81,53.98 J3.6
S1-5V3
  Bottom 0.254: IC7.5 27.3,33.02 26.67,32.38 13.34,32.38 6.99,26.04 J4.1
S1-5V4  (via drill 0.61)
  Top 0.254: IC3.12 53.98,48.26 55.24,46.99 55.24,46.35 v54.61,45.72 | v5.08,37.47 5.08,34.92 3.81,33.66 J4.6
  Bottom 0.254: v54.61,45.72 13.34,45.72 v5.08,37.47
S1-5V5  (via drill 0.61)
  Top 0.254: v12.06,33.66 12.06,40.64 6.99,45.72 J3.1
  Bottom 0.254: v12.06,33.66 24.13,33.66 24.77,33.02 IC7.10
SCK
  Top 0.254: J1.23 44.45,73.66 44.45,71.75 46.99,69.22 49.53,69.22 57.78,60.96 M1.5
  Bottom 0.254: IC2.13 73.66,39.37 81.28,39.37 83.19,41.27 83.19,50.16 80.01,50.16 70.48,59.69 70.48,62.23 61.59,62.23 60.33,60.96 M1.5
SCL  (via drill 0.61)
  Top 0.254: v19.68,52.7 U$2.6 | v13.34,50.16 11.43,50.16 R16.2
  Bottom 0.254: IC6.6 25.4,51.44 20.95,51.44 v19.68,52.7 15.88,52.7 v13.34,50.16
SDA  (via drill 0.61)
  Top 0.254: v26.67,52.7 22.23,57.15 19.68,57.15 18.41,55.88 U$2.5 | v10.16,53.34 10.16,58.42 10.79,59.05 11.43,59.05 R15.2
  Bottom 0.254: v26.67,52.7 IC6.5 27.94,47.62 10.16,47.62 v10.16,53.34
SQ  (via drill 0.61)
  Top 0.254: v20.95,53.98 U$2.7 | v17.14,53.98 15.24,52.07 R11.1
  Bottom 0.254: v17.14,53.98 v20.95,53.98
TX  (via drill 0.61)
  Top 0.254: JP2.1 88.9,15.88 85.72,19.05 v85.72,41.91 | v85.72,50.8 85.72,52.7 J1.8
  Bottom 0.254: v85.72,50.8 v85.72,41.91
UVLO  (via drill 0.5)
  Top 0.254: R18.1 45.72,27.94 42.55,27.94 C4.2 42.55,27.3 R19.2 39.59,26.25 v39.37,26.04 | v38.1,24.13 36.83,24.13 36.2,23.5 36.2,23.2 U2.7
  Bottom 0.254: v39.37,26.04 39.37,25.4 v38.1,24.13
VCC  (via drill 0.5)
  Top 0.254: C9.1 20.32,15.24 21.59,16.51 24.13,16.51 25.4,15.24 D2.C 27.94,15.24 27.94,13.97 26.67,12.7 v26.67,10.16 | 59.69,3.17 57.78,3.17 R27.2 57.78,2.54 R23.2 53.07,6.08 v53.34,6.35 | 59.69,3.17 61.59,3.17 | 61.59,3.17 65.41,3.17 R25.2 | 61.59,3.17 R26.2 | IC4.P$17 IC4.P$18 IC4.P$19 54.74,17.91 55.56,18.73 | IC4.P$4 IC4.P$3 52.7,15.24 52.07,14.61 50.8,14.61 50.16,15.24 50.16,17.14 51.75,18.73 55.56,18.73 | IC4.P$9 55.74,12.84 56.52,12.06 v59.69,12.06 | v59.69,5.08 59.69,3.17 | 55.56,18.73 55.88,19.05 58.42,19.05 59.05,18.41 v59.05,17.14 | C10.+ v48.26,7.62
  Bottom 0.254: v59.69,5.08 v59.69,12.06 59.05,12.7 v59.05,17.14 | v48.26,7.62 49.53,6.35 v53.34,6.35 | C10.+ 35.56,3.81 33.02,3.81 v26.67,10.16
VIN  (via drill 0.5, 0.61)
  Top 0.254: 40.01,25.4 42.55,25.4 C4.1 42.55,26.04 45.72,26.04 R18.2 | 40.01,25.4 36.83,25.4 35.56,24.13 U2.8 35.56,22.86 | 40.01,25.4 C6.1 | v41.91,20.95 40.01,22.86 C6.1 | IC4.P$20 IC4.P$1 53.28,16.57 v52.07,17.78 | v46.35,15.88 46.09,16.14 C7.1 43.81,16.51 43.18,17.14 v41.91,17.14 L1.P$2 38.1,17.38 38.1,19.05 37.03,20.11 U2.5 | U2.6 39.93,23.07 C6.1
  Bottom 0.254: v41.91,20.95 v41.91,17.14 | v46.35,15.88 47.62,15.88 49.53,17.78 v52.07,17.78